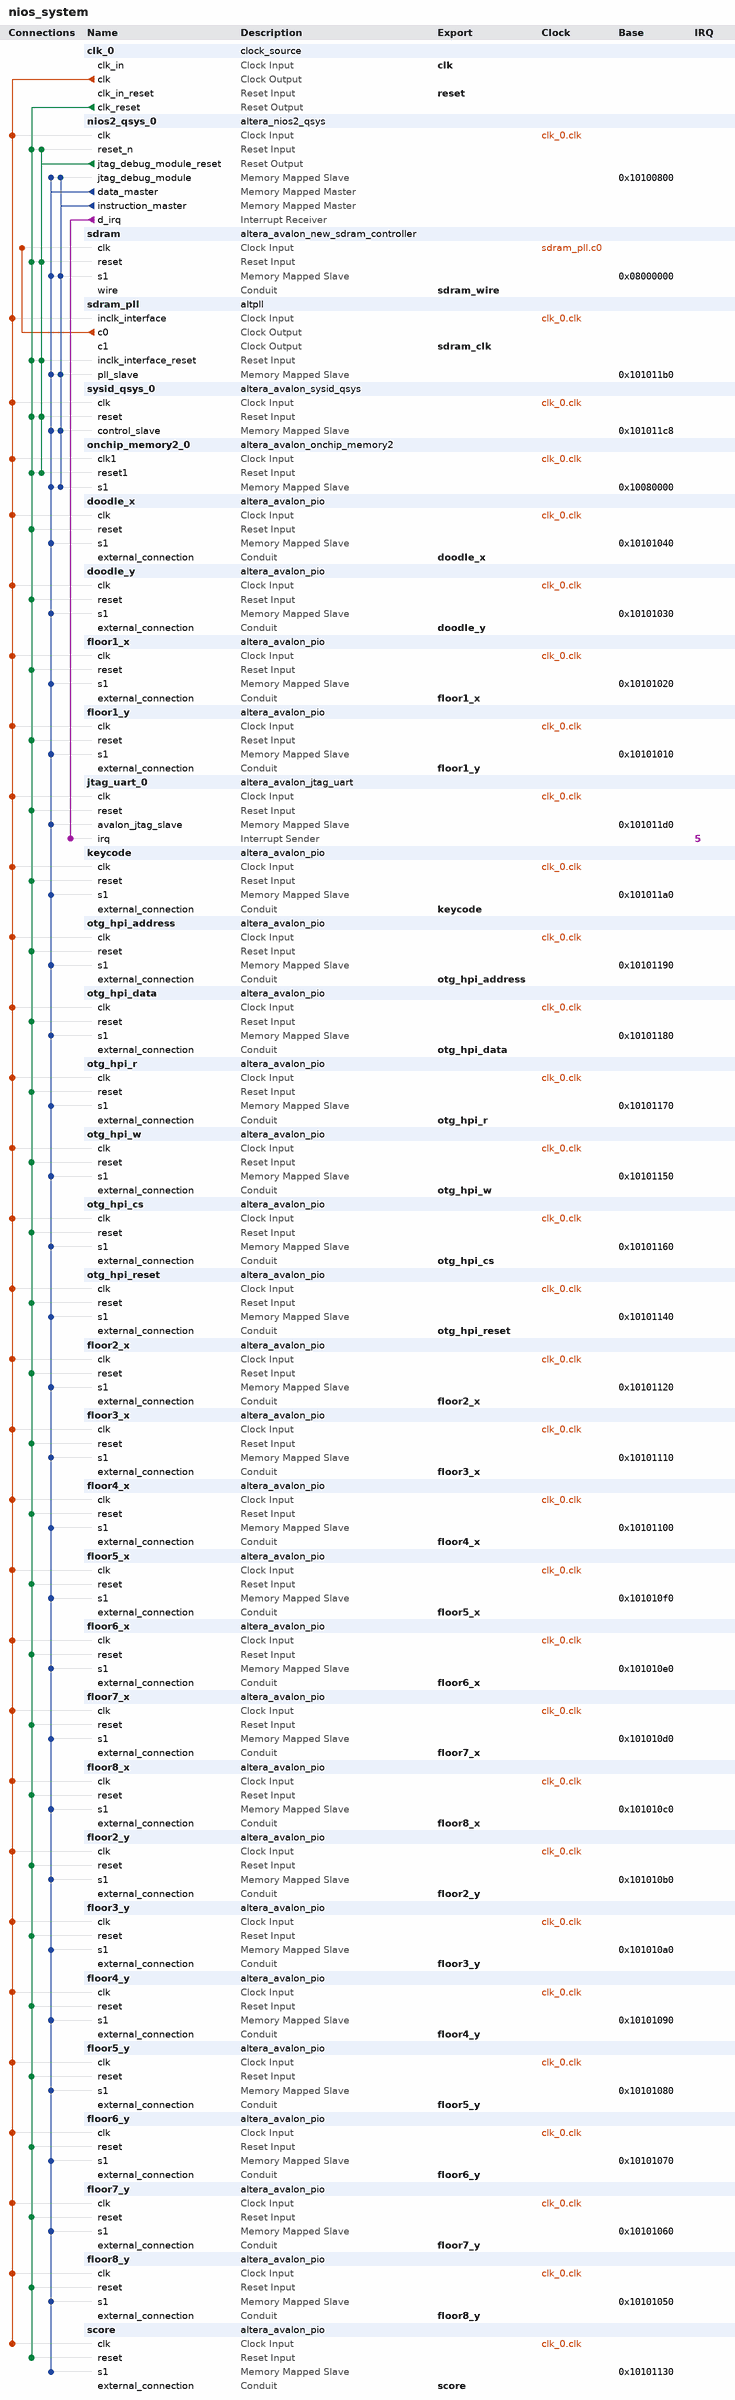
[diagram p0: system contents]
# Platform Designer (Qsys) system nios_system, Cyclone IV E EP4CE115F29C7
# Parameters at their usual value, and those the tool derives, are not listed.
package require -exact qsys 18.1
create_system nios_system
set_project_property DEVICE_FAMILY {Cyclone IV E}
set_project_property DEVICE EP4CE115F29C7

add_instance clk_0 clock_source 18.1
set_instance_parameter_value clk_0 clockFrequency 50000000

add_instance nios2_qsys_0 altera_nios2_qsys 16.1
set_instance_parameter_value nios2_qsys_0 breakSlave nios2_qsys_0.jtag_debug_module
set_instance_parameter_value nios2_qsys_0 exceptionSlave sdram.s1
set_instance_parameter_value nios2_qsys_0 icache_size 4096
set_instance_parameter_value nios2_qsys_0 impl Tiny
set_instance_parameter_value nios2_qsys_0 mmu_TLBMissExcSlave None
set_instance_parameter_value nios2_qsys_0 resetSlave sdram.s1
set_instance_parameter_value nios2_qsys_0 resetrequest_enabled true

add_instance sdram altera_avalon_new_sdram_controller 18.1
set_instance_parameter_value sdram TAC 5.5
set_instance_parameter_value sdram TRCD 20.0
set_instance_parameter_value sdram TRP 20.0
set_instance_parameter_value sdram casLatency 3
set_instance_parameter_value sdram columnWidth 10
set_instance_parameter_value sdram dataWidth 32
set_instance_parameter_value sdram generateSimulationModel false
set_instance_parameter_value sdram model single_Micron_MT48LC4M32B2_7_chip
set_instance_parameter_value sdram numberOfBanks 4
set_instance_parameter_value sdram numberOfChipSelects 1
set_instance_parameter_value sdram powerUpDelay 200.0
set_instance_parameter_value sdram refreshPeriod 7.8125
set_instance_parameter_value sdram rowWidth 13

add_instance sdram_pll altpll 18.1
set_instance_parameter_value sdram_pll CLK0_DIVIDE_BY 1
set_instance_parameter_value sdram_pll CLK0_MULTIPLY_BY 1
set_instance_parameter_value sdram_pll CLK1_DIVIDE_BY 1
set_instance_parameter_value sdram_pll CLK1_DUTY_CYCLE 50
set_instance_parameter_value sdram_pll CLK1_MULTIPLY_BY 1
set_instance_parameter_value sdram_pll CLK1_PHASE_SHIFT -3000
set_instance_parameter_value sdram_pll INCLK0_INPUT_FREQUENCY 20000
set_instance_parameter_value sdram_pll PORT_ARESET PORT_UNUSED
set_instance_parameter_value sdram_pll PORT_LOCKED PORT_UNUSED
set_instance_parameter_value sdram_pll PORT_clk1 PORT_USED
set_instance_parameter_value sdram_pll PORT_clk2 PORT_UNUSED
set_instance_parameter_value sdram_pll PORT_clk3 PORT_UNUSED

add_instance sysid_qsys_0 altera_avalon_sysid_qsys 18.1
set_instance_parameter_value sysid_qsys_0 id 0

add_instance onchip_memory2_0 altera_avalon_onchip_memory2 18.1
set_instance_parameter_value onchip_memory2_0 dataWidth 8
set_instance_parameter_value onchip_memory2_0 dualPort false
set_instance_parameter_value onchip_memory2_0 initMemContent true
set_instance_parameter_value onchip_memory2_0 initializationFileName onchip_mem.hex
set_instance_parameter_value onchip_memory2_0 memorySize 400000

add_instance doodle_x altera_avalon_pio 18.1
set_instance_parameter_value doodle_x direction Output
set_instance_parameter_value doodle_x width 10

add_instance doodle_y altera_avalon_pio 18.1
set_instance_parameter_value doodle_y direction Output
set_instance_parameter_value doodle_y width 10

add_instance floor1_x altera_avalon_pio 18.1
set_instance_parameter_value floor1_x direction Output
set_instance_parameter_value floor1_x width 10

add_instance floor1_y altera_avalon_pio 18.1
set_instance_parameter_value floor1_y direction Output
set_instance_parameter_value floor1_y width 10

add_instance jtag_uart_0 altera_avalon_jtag_uart 18.1
set_instance_parameter_value jtag_uart_0 simInteractiveOptions NO_INTERACTIVE_WINDOWS

add_instance keycode altera_avalon_pio 18.1
set_instance_parameter_value keycode direction Output
set_instance_parameter_value keycode width 8

add_instance otg_hpi_address altera_avalon_pio 18.1
set_instance_parameter_value otg_hpi_address direction Output
set_instance_parameter_value otg_hpi_address width 2

add_instance otg_hpi_data altera_avalon_pio 18.1
set_instance_parameter_value otg_hpi_data direction InOut
set_instance_parameter_value otg_hpi_data width 16

add_instance otg_hpi_r altera_avalon_pio 18.1
set_instance_parameter_value otg_hpi_r direction Output
set_instance_parameter_value otg_hpi_r width 1

add_instance otg_hpi_w altera_avalon_pio 18.1
set_instance_parameter_value otg_hpi_w direction Output
set_instance_parameter_value otg_hpi_w width 1

add_instance otg_hpi_cs altera_avalon_pio 18.1
set_instance_parameter_value otg_hpi_cs direction Output
set_instance_parameter_value otg_hpi_cs width 1

add_instance otg_hpi_reset altera_avalon_pio 18.1
set_instance_parameter_value otg_hpi_reset direction Output
set_instance_parameter_value otg_hpi_reset width 1

add_instance floor2_x altera_avalon_pio 18.1
set_instance_parameter_value floor2_x direction Output
set_instance_parameter_value floor2_x width 10

add_instance floor3_x altera_avalon_pio 18.1
set_instance_parameter_value floor3_x direction Output
set_instance_parameter_value floor3_x width 10

add_instance floor4_x altera_avalon_pio 18.1
set_instance_parameter_value floor4_x direction Output
set_instance_parameter_value floor4_x width 10

add_instance floor5_x altera_avalon_pio 18.1
set_instance_parameter_value floor5_x direction Output
set_instance_parameter_value floor5_x width 10

add_instance floor6_x altera_avalon_pio 18.1
set_instance_parameter_value floor6_x direction Output
set_instance_parameter_value floor6_x width 10

add_instance floor7_x altera_avalon_pio 18.1
set_instance_parameter_value floor7_x direction Output
set_instance_parameter_value floor7_x width 10

add_instance floor8_x altera_avalon_pio 18.1
set_instance_parameter_value floor8_x direction Output
set_instance_parameter_value floor8_x width 10

add_instance floor2_y altera_avalon_pio 18.1
set_instance_parameter_value floor2_y direction Output
set_instance_parameter_value floor2_y width 10

add_instance floor3_y altera_avalon_pio 18.1
set_instance_parameter_value floor3_y direction Output
set_instance_parameter_value floor3_y width 10

add_instance floor4_y altera_avalon_pio 18.1
set_instance_parameter_value floor4_y direction Output
set_instance_parameter_value floor4_y width 10

add_instance floor5_y altera_avalon_pio 18.1
set_instance_parameter_value floor5_y direction Output
set_instance_parameter_value floor5_y width 10

add_instance floor6_y altera_avalon_pio 18.1
set_instance_parameter_value floor6_y direction Output
set_instance_parameter_value floor6_y width 10

add_instance floor7_y altera_avalon_pio 18.1
set_instance_parameter_value floor7_y direction Output
set_instance_parameter_value floor7_y width 10

add_instance floor8_y altera_avalon_pio 18.1
set_instance_parameter_value floor8_y direction Output
set_instance_parameter_value floor8_y width 10

add_instance score altera_avalon_pio 18.1
set_instance_parameter_value score direction Output
set_instance_parameter_value score width 16

# connections
add_connection clk_0.clk doodle_x.clk clock
add_connection clk_0.clk doodle_y.clk clock
add_connection clk_0.clk floor1_x.clk clock
add_connection clk_0.clk floor1_y.clk clock
add_connection clk_0.clk floor2_x.clk clock
add_connection clk_0.clk floor2_y.clk clock
add_connection clk_0.clk floor3_x.clk clock
add_connection clk_0.clk floor3_y.clk clock
add_connection clk_0.clk floor4_x.clk clock
add_connection clk_0.clk floor4_y.clk clock
add_connection clk_0.clk floor5_x.clk clock
add_connection clk_0.clk floor5_y.clk clock
add_connection clk_0.clk floor6_x.clk clock
add_connection clk_0.clk floor6_y.clk clock
add_connection clk_0.clk floor7_x.clk clock
add_connection clk_0.clk floor7_y.clk clock
add_connection clk_0.clk floor8_x.clk clock
add_connection clk_0.clk floor8_y.clk clock
add_connection clk_0.clk jtag_uart_0.clk clock
add_connection clk_0.clk keycode.clk clock
add_connection clk_0.clk nios2_qsys_0.clk clock
add_connection clk_0.clk onchip_memory2_0.clk1 clock
add_connection clk_0.clk otg_hpi_address.clk clock
add_connection clk_0.clk otg_hpi_cs.clk clock
add_connection clk_0.clk otg_hpi_data.clk clock
add_connection clk_0.clk otg_hpi_r.clk clock
add_connection clk_0.clk otg_hpi_reset.clk clock
add_connection clk_0.clk otg_hpi_w.clk clock
add_connection clk_0.clk score.clk clock
add_connection clk_0.clk sdram_pll.inclk_interface clock
add_connection clk_0.clk sysid_qsys_0.clk clock
add_connection sdram_pll.c0 sdram.clk clock
add_connection clk_0.clk_reset doodle_x.reset reset
add_connection clk_0.clk_reset doodle_y.reset reset
add_connection clk_0.clk_reset floor1_x.reset reset
add_connection clk_0.clk_reset floor1_y.reset reset
add_connection clk_0.clk_reset floor2_x.reset reset
add_connection clk_0.clk_reset floor2_y.reset reset
add_connection clk_0.clk_reset floor3_x.reset reset
add_connection clk_0.clk_reset floor3_y.reset reset
add_connection clk_0.clk_reset floor4_x.reset reset
add_connection clk_0.clk_reset floor4_y.reset reset
add_connection clk_0.clk_reset floor5_x.reset reset
add_connection clk_0.clk_reset floor5_y.reset reset
add_connection clk_0.clk_reset floor6_x.reset reset
add_connection clk_0.clk_reset floor6_y.reset reset
add_connection clk_0.clk_reset floor7_x.reset reset
add_connection clk_0.clk_reset floor7_y.reset reset
add_connection clk_0.clk_reset floor8_x.reset reset
add_connection clk_0.clk_reset floor8_y.reset reset
add_connection clk_0.clk_reset jtag_uart_0.reset reset
add_connection clk_0.clk_reset keycode.reset reset
add_connection clk_0.clk_reset nios2_qsys_0.reset_n reset
add_connection clk_0.clk_reset onchip_memory2_0.reset1 reset
add_connection clk_0.clk_reset otg_hpi_address.reset reset
add_connection clk_0.clk_reset otg_hpi_cs.reset reset
add_connection clk_0.clk_reset otg_hpi_data.reset reset
add_connection clk_0.clk_reset otg_hpi_r.reset reset
add_connection clk_0.clk_reset otg_hpi_reset.reset reset
add_connection clk_0.clk_reset otg_hpi_w.reset reset
add_connection clk_0.clk_reset score.reset reset
add_connection clk_0.clk_reset sdram.reset reset
add_connection clk_0.clk_reset sdram_pll.inclk_interface_reset reset
add_connection clk_0.clk_reset sysid_qsys_0.reset reset
add_connection nios2_qsys_0.jtag_debug_module_reset nios2_qsys_0.reset_n reset
add_connection nios2_qsys_0.jtag_debug_module_reset onchip_memory2_0.reset1 reset
add_connection nios2_qsys_0.jtag_debug_module_reset sdram.reset reset
add_connection nios2_qsys_0.jtag_debug_module_reset sdram_pll.inclk_interface_reset reset
add_connection nios2_qsys_0.jtag_debug_module_reset sysid_qsys_0.reset reset
add_connection nios2_qsys_0.data_master doodle_x.s1 avalon
set_connection_parameter_value nios2_qsys_0.data_master/doodle_x.s1 baseAddress 0x10101040
add_connection nios2_qsys_0.data_master doodle_y.s1 avalon
set_connection_parameter_value nios2_qsys_0.data_master/doodle_y.s1 baseAddress 0x10101030
add_connection nios2_qsys_0.data_master floor1_x.s1 avalon
set_connection_parameter_value nios2_qsys_0.data_master/floor1_x.s1 baseAddress 0x10101020
add_connection nios2_qsys_0.data_master floor1_y.s1 avalon
set_connection_parameter_value nios2_qsys_0.data_master/floor1_y.s1 baseAddress 0x10101010
add_connection nios2_qsys_0.data_master floor2_x.s1 avalon
set_connection_parameter_value nios2_qsys_0.data_master/floor2_x.s1 baseAddress 0x10101120
add_connection nios2_qsys_0.data_master floor2_y.s1 avalon
set_connection_parameter_value nios2_qsys_0.data_master/floor2_y.s1 baseAddress 0x101010b0
add_connection nios2_qsys_0.data_master floor3_x.s1 avalon
set_connection_parameter_value nios2_qsys_0.data_master/floor3_x.s1 baseAddress 0x10101110
add_connection nios2_qsys_0.data_master floor3_y.s1 avalon
set_connection_parameter_value nios2_qsys_0.data_master/floor3_y.s1 baseAddress 0x101010a0
add_connection nios2_qsys_0.data_master floor4_x.s1 avalon
set_connection_parameter_value nios2_qsys_0.data_master/floor4_x.s1 baseAddress 0x10101100
add_connection nios2_qsys_0.data_master floor4_y.s1 avalon
set_connection_parameter_value nios2_qsys_0.data_master/floor4_y.s1 baseAddress 0x10101090
add_connection nios2_qsys_0.data_master floor5_x.s1 avalon
set_connection_parameter_value nios2_qsys_0.data_master/floor5_x.s1 baseAddress 0x101010f0
add_connection nios2_qsys_0.data_master floor5_y.s1 avalon
set_connection_parameter_value nios2_qsys_0.data_master/floor5_y.s1 baseAddress 0x10101080
add_connection nios2_qsys_0.data_master floor6_x.s1 avalon
set_connection_parameter_value nios2_qsys_0.data_master/floor6_x.s1 baseAddress 0x101010e0
add_connection nios2_qsys_0.data_master floor6_y.s1 avalon
set_connection_parameter_value nios2_qsys_0.data_master/floor6_y.s1 baseAddress 0x10101070
add_connection nios2_qsys_0.data_master floor7_x.s1 avalon
set_connection_parameter_value nios2_qsys_0.data_master/floor7_x.s1 baseAddress 0x101010d0
add_connection nios2_qsys_0.data_master floor7_y.s1 avalon
set_connection_parameter_value nios2_qsys_0.data_master/floor7_y.s1 baseAddress 0x10101060
add_connection nios2_qsys_0.data_master floor8_x.s1 avalon
set_connection_parameter_value nios2_qsys_0.data_master/floor8_x.s1 baseAddress 0x101010c0
add_connection nios2_qsys_0.data_master floor8_y.s1 avalon
set_connection_parameter_value nios2_qsys_0.data_master/floor8_y.s1 baseAddress 0x10101050
add_connection nios2_qsys_0.data_master jtag_uart_0.avalon_jtag_slave avalon
set_connection_parameter_value nios2_qsys_0.data_master/jtag_uart_0.avalon_jtag_slave baseAddress 0x101011d0
add_connection nios2_qsys_0.data_master keycode.s1 avalon
set_connection_parameter_value nios2_qsys_0.data_master/keycode.s1 baseAddress 0x101011a0
add_connection nios2_qsys_0.data_master nios2_qsys_0.jtag_debug_module avalon
set_connection_parameter_value nios2_qsys_0.data_master/nios2_qsys_0.jtag_debug_module baseAddress 0x10100800
add_connection nios2_qsys_0.data_master onchip_memory2_0.s1 avalon
set_connection_parameter_value nios2_qsys_0.data_master/onchip_memory2_0.s1 baseAddress 0x10080000
add_connection nios2_qsys_0.data_master otg_hpi_address.s1 avalon
set_connection_parameter_value nios2_qsys_0.data_master/otg_hpi_address.s1 baseAddress 0x10101190
add_connection nios2_qsys_0.data_master otg_hpi_cs.s1 avalon
set_connection_parameter_value nios2_qsys_0.data_master/otg_hpi_cs.s1 baseAddress 0x10101160
add_connection nios2_qsys_0.data_master otg_hpi_data.s1 avalon
set_connection_parameter_value nios2_qsys_0.data_master/otg_hpi_data.s1 baseAddress 0x10101180
add_connection nios2_qsys_0.data_master otg_hpi_r.s1 avalon
set_connection_parameter_value nios2_qsys_0.data_master/otg_hpi_r.s1 baseAddress 0x10101170
add_connection nios2_qsys_0.data_master otg_hpi_reset.s1 avalon
set_connection_parameter_value nios2_qsys_0.data_master/otg_hpi_reset.s1 baseAddress 0x10101140
add_connection nios2_qsys_0.data_master otg_hpi_w.s1 avalon
set_connection_parameter_value nios2_qsys_0.data_master/otg_hpi_w.s1 baseAddress 0x10101150
add_connection nios2_qsys_0.data_master score.s1 avalon
set_connection_parameter_value nios2_qsys_0.data_master/score.s1 baseAddress 0x10101130
add_connection nios2_qsys_0.data_master sdram.s1 avalon
set_connection_parameter_value nios2_qsys_0.data_master/sdram.s1 baseAddress 0x08000000
add_connection nios2_qsys_0.data_master sdram_pll.pll_slave avalon
set_connection_parameter_value nios2_qsys_0.data_master/sdram_pll.pll_slave baseAddress 0x101011b0
add_connection nios2_qsys_0.data_master sysid_qsys_0.control_slave avalon
set_connection_parameter_value nios2_qsys_0.data_master/sysid_qsys_0.control_slave baseAddress 0x101011c8
add_connection nios2_qsys_0.instruction_master nios2_qsys_0.jtag_debug_module avalon
set_connection_parameter_value nios2_qsys_0.instruction_master/nios2_qsys_0.jtag_debug_module baseAddress 0x10100800
add_connection nios2_qsys_0.instruction_master onchip_memory2_0.s1 avalon
set_connection_parameter_value nios2_qsys_0.instruction_master/onchip_memory2_0.s1 baseAddress 0x10080000
add_connection nios2_qsys_0.instruction_master sdram.s1 avalon
set_connection_parameter_value nios2_qsys_0.instruction_master/sdram.s1 baseAddress 0x08000000
add_connection nios2_qsys_0.instruction_master sdram_pll.pll_slave avalon
set_connection_parameter_value nios2_qsys_0.instruction_master/sdram_pll.pll_slave baseAddress 0x101011b0
add_connection nios2_qsys_0.instruction_master sysid_qsys_0.control_slave avalon
set_connection_parameter_value nios2_qsys_0.instruction_master/sysid_qsys_0.control_slave baseAddress 0x101011c8
add_connection nios2_qsys_0.d_irq jtag_uart_0.irq interrupt
set_connection_parameter_value nios2_qsys_0.d_irq/jtag_uart_0.irq irqNumber 5

# exported interfaces
add_interface clk clock sink
set_interface_property clk EXPORT_OF clk_0.clk_in
add_interface doodle_x conduit end
set_interface_property doodle_x EXPORT_OF doodle_x.external_connection
add_interface doodle_y conduit end
set_interface_property doodle_y EXPORT_OF doodle_y.external_connection
add_interface floor1_x conduit end
set_interface_property floor1_x EXPORT_OF floor1_x.external_connection
add_interface floor1_y conduit end
set_interface_property floor1_y EXPORT_OF floor1_y.external_connection
add_interface floor2_x conduit end
set_interface_property floor2_x EXPORT_OF floor2_x.external_connection
add_interface floor2_y conduit end
set_interface_property floor2_y EXPORT_OF floor2_y.external_connection
add_interface floor3_x conduit end
set_interface_property floor3_x EXPORT_OF floor3_x.external_connection
add_interface floor3_y conduit end
set_interface_property floor3_y EXPORT_OF floor3_y.external_connection
add_interface floor4_x conduit end
set_interface_property floor4_x EXPORT_OF floor4_x.external_connection
add_interface floor4_y conduit end
set_interface_property floor4_y EXPORT_OF floor4_y.external_connection
add_interface floor5_x conduit end
set_interface_property floor5_x EXPORT_OF floor5_x.external_connection
add_interface floor5_y conduit end
set_interface_property floor5_y EXPORT_OF floor5_y.external_connection
add_interface floor6_x conduit end
set_interface_property floor6_x EXPORT_OF floor6_x.external_connection
add_interface floor6_y conduit end
set_interface_property floor6_y EXPORT_OF floor6_y.external_connection
add_interface floor7_x conduit end
set_interface_property floor7_x EXPORT_OF floor7_x.external_connection
add_interface floor7_y conduit end
set_interface_property floor7_y EXPORT_OF floor7_y.external_connection
add_interface floor8_x conduit end
set_interface_property floor8_x EXPORT_OF floor8_x.external_connection
add_interface floor8_y conduit end
set_interface_property floor8_y EXPORT_OF floor8_y.external_connection
add_interface keycode conduit end
set_interface_property keycode EXPORT_OF keycode.external_connection
add_interface otg_hpi_address conduit end
set_interface_property otg_hpi_address EXPORT_OF otg_hpi_address.external_connection
add_interface otg_hpi_cs conduit end
set_interface_property otg_hpi_cs EXPORT_OF otg_hpi_cs.external_connection
add_interface otg_hpi_data conduit end
set_interface_property otg_hpi_data EXPORT_OF otg_hpi_data.external_connection
add_interface otg_hpi_r conduit end
set_interface_property otg_hpi_r EXPORT_OF otg_hpi_r.external_connection
add_interface otg_hpi_reset conduit end
set_interface_property otg_hpi_reset EXPORT_OF otg_hpi_reset.external_connection
add_interface otg_hpi_w conduit end
set_interface_property otg_hpi_w EXPORT_OF otg_hpi_w.external_connection
add_interface reset reset sink
set_interface_property reset EXPORT_OF clk_0.clk_in_reset
add_interface score conduit end
set_interface_property score EXPORT_OF score.external_connection
add_interface sdram_clk clock source
set_interface_property sdram_clk EXPORT_OF sdram_pll.c1
add_interface sdram_wire conduit end
set_interface_property sdram_wire EXPORT_OF sdram.wire

set_interconnect_requirement {$system} qsys_mm.clockCrossingAdapter HANDSHAKE
set_interconnect_requirement {$system} qsys_mm.enableEccProtection FALSE
set_interconnect_requirement {$system} qsys_mm.insertDefaultSlave FALSE
set_interconnect_requirement {$system} qsys_mm.maxAdditionalLatency 1

save_system nios_system.qsys
